# EAGLE design working (EAGLE 6.4)
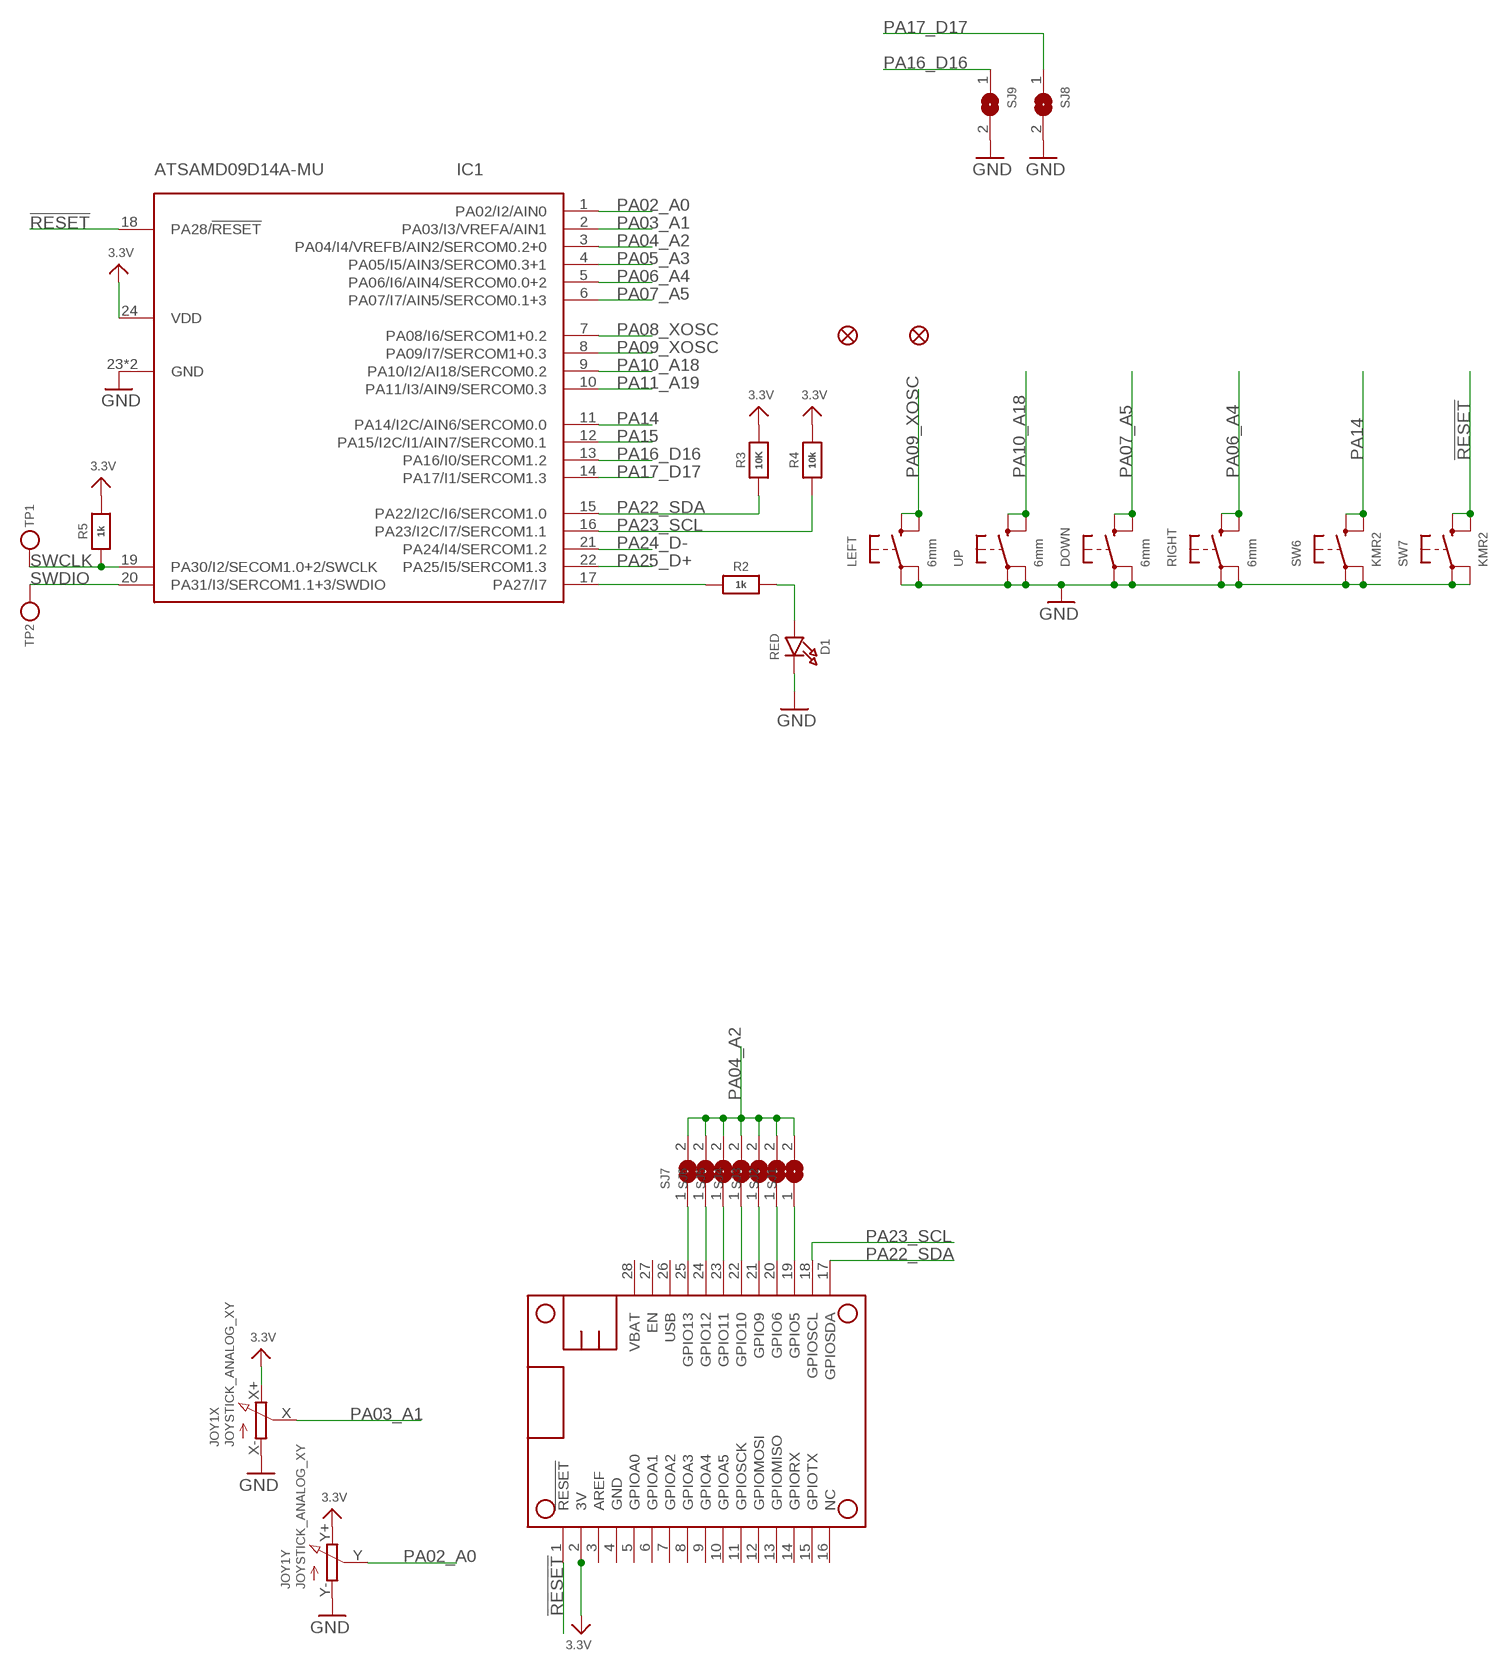
[diagram p0: schematic, sheet 1]

## Parts
D1  RED  LED0805_NOOUTLINE  [CHIPLED_0805_NOOUTLINE]
DOWN  6mm  SWITCH_TACT_SMT_EVQQ2_SMALL  [EVQ-Q2_SMALLER]
FID1  FIDUCIAL_1MM  [FIDUCIAL_1MM]
FID2  FIDUCIAL_1MM  [FIDUCIAL_1MM]
IC1  ATSAMD09D14A-MU  [QFN24_4MM]
JOY1  JOYSTICK_ANALOG_XY  [JOYSTICK_ANALOG_MINITHM]
LEFT  6mm  SWITCH_TACT_SMT_EVQQ2_SMALL  [EVQ-Q2_SMALLER]
MS1  FEATHERWING  [FEATHERWING]
R2  1k  RESISTOR_0603_NOOUT  [0603-NO]
R3  10K  RESISTOR_0603_NOOUT  [0603-NO]
R4  10k  RESISTOR_0603_NOOUT  [0603-NO]
R5  1k  RESISTOR_0603_NOOUT  [0603-NO]
RIGHT  6mm  SWITCH_TACT_SMT_EVQQ2_SMALL  [EVQ-Q2_SMALLER]
SJ1  SOLDERJUMPER  [SOLDERJUMPER_ARROW_NOPASTE]
SJ2  SOLDERJUMPER  [SOLDERJUMPER_ARROW_NOPASTE]
SJ3  SOLDERJUMPER  [SOLDERJUMPER_ARROW_NOPASTE]
SJ4  SOLDERJUMPER  [SOLDERJUMPER_ARROW_NOPASTE]
SJ5  SOLDERJUMPER  [SOLDERJUMPER_ARROW_NOPASTE]
SJ6  SOLDERJUMPER  [SOLDERJUMPER_ARROW_NOPASTE]
SJ7  SOLDERJUMPER  [SOLDERJUMPER_ARROW_NOPASTE]
SJ8  SOLDERJUMPER  [SOLDERJUMPER_ARROW_NOPASTE]
SJ9  SOLDERJUMPER  [SOLDERJUMPER_ARROW_NOPASTE]
SW6  KMR2  SWITCH_TACT_SMT4.6X2.8  [BTN_KMR2_4.6X2.8]
SW7  KMR2  SWITCH_TACT_SMT4.6X2.8  [BTN_KMR2_4.6X2.8]
TP1  TESTPOINTROUND2MM  [TESTPOINT_ROUND_2MM]
TP2  TESTPOINTROUND2MM  [TESTPOINT_ROUND_2MM]
UP  6mm  SWITCH_TACT_SMT_EVQQ2_SMALL  [EVQ-Q2_SMALLER]

## Nets
3.3V: IC1.24(VDD) JOY1.X+(X:E) JOY1.Y+(Y:E) MS1.2(3V) R3.2 R4.2 R5.2
!RESET: IC1.18(PA28/!RESET) MS1.1(!RESET) SW7.B'(S1) SW7.B(S)
GND: D1.C DOWN.A'(P1) DOWN.A(P) IC1.23(GND) IC1.THERM(GND) JOY1.X-(X:A) JOY1.Y-(Y:A) LEFT.A'(P1) LEFT.A(P) RIGHT.A'(P1) RIGHT.A(P) SJ8.2 SJ9.2 SW6.A'(P1) SW6.A(P) SW7.A'(P1) SW7.A(P) UP.A'(P1) UP.A(P)
N$1: MS1.19(GPIO5) SJ1.1
N$2: MS1.20(GPIO6) SJ2.1
N$3: MS1.21(GPIO9) SJ3.1
N$4: MS1.22(GPIO10) SJ4.1
N$5: IC1.17(PA27/I7) R2.1
N$6: MS1.23(GPIO11) SJ5.1
N$7: MS1.24(GPIO12) SJ6.1
N$8: MS1.25(GPIO13) SJ7.1
N$9: D1.A R2.2
PA02_A0: IC1.1(PA02/I2/AIN0) JOY1.Y(Y:S)
PA03_A1: IC1.2(PA03/I3/VREFA/AIN1) JOY1.X(X:S)
PA04_A2: IC1.3(PA04/I4/VREFB/AIN2/SERCOM0.2+0) SJ1.2 SJ2.2 SJ3.2 SJ4.2 SJ5.2 SJ6.2 SJ7.2
PA05_A3: IC1.4(PA05/I5/AIN3/SERCOM0.3+1)
PA06_A4: IC1.5(PA06/I6/AIN4/SERCOM0.0+2) RIGHT.B'(S1) RIGHT.B(S)
PA07_A5: DOWN.B'(S1) DOWN.B(S) IC1.6(PA07/I7/AIN5/SERCOM0.1+3)
PA08_XOSC: IC1.7(PA08/I6/SERCOM1+0.2)
PA09_XOSC: IC1.8(PA09/I7/SERCOM1+0.3) LEFT.B'(S1) LEFT.B(S)
PA10_A18: IC1.9(PA10/I2/AI18/SERCOM0.2) UP.B'(S1) UP.B(S)
PA11_A19: IC1.10(PA11/I3/AIN9/SERCOM0.3)
PA14: IC1.11(PA14/I2C/AIN6/SERCOM0.0) SW6.B'(S1) SW6.B(S)
PA15: IC1.12(PA15/I2C/I1/AIN7/SERCOM0.1)
PA16_D16: IC1.13(PA16/I0/SERCOM1.2) SJ9.1
PA17_D17: IC1.14(PA17/I1/SERCOM1.3) SJ8.1
PA22_SDA: IC1.15(PA22/I2C/I6/SERCOM1.0) MS1.17(GPIOSDA) R3.1
PA23_SCL: IC1.16(PA23/I2C/I7/SERCOM1.1) MS1.18(GPIOSCL) R4.1
PA24_D-: IC1.21(PA24/I4/SERCOM1.2)
PA25_D+: IC1.22(PA25/I5/SERCOM1.3)
SWCLK: IC1.19(PA30/I2/SECOM1.0+2/SWCLK) R5.1 TP1.P$1
SWDIO: IC1.20(PA31/I3/SERCOM1.1+3/SWDIO) TP2.P$1
Unconnected: MS1.3(AREF) MS1.5(GPIOA0) MS1.6(GPIOA1) MS1.7(GPIOA2) MS1.8(GPIOA3) MS1.9(GPIOA4) MS1.10(GPIOA5) MS1.11(GPIOSCK) MS1.12(GPIOMOSI) MS1.13(GPIOMISO) MS1.14(GPIORX) MS1.15(GPIOTX) MS1.16(NC) MS1.26(USB) MS1.27(EN) MS1.28(VBAT)

## Power pins joined to a net without a drawn wire
GND: MS1.4(GND)

## Library data of the parts
D1 = microbuilder:LED: LED 0603 - 0603 Surface Mount Package 2mA: Green LED - Low Power (3.9mcd, 2ma, 1.7Vf) - Digikey: 475-2709-2-ND Orange LED - Low Power (9.8mcd, 2ma, 1.8Vf) - Digikey: 475-1194-2-ND Red LED - Low Power (5mcd, 2ma, 1.8Vf) - Digikey: 475-1195-2-ND Yellow LED - Low Power (7mcd, 2ma, 1.8Vf) - Digikey: 475-1196-2-ND 5mA: Blue LED - Low Power (17mcd, 5ma, 2.9Vf) - Digikey: LNJ937W8CRACT-ND 0805 - 0805 Surface Mount Package 2mA: Red LED (8.8mcd, 2mA, 1.8Vf, Clear) - Low Power [Digikey: 475-2510-1-ND] Green LED (5mcd, 2mA, 1.8Vf, Clear) - Low Power [Digikey: 475-2730-1-ND] Yellow LED (11.3mcd, 2mA, 1.8Vf, Clear) - Low Power [Digikey: 475-2555-1-ND] 20mA: Red LED (104mcd, 20mA, Diffused) - LS R976 [Digikey: 475-1278-6-ND] Red LED (12mcd, 20mA, 2.0Vf, Clear) - APT2012EC [Digikey: 754-1128-1-ND] Green LED (15mcd, 20mA, 2.2Vf, Clear) - APT2012GC [Digikey: 754-1131-1-ND] Orange LED (160mcd, 20mA, 2.1Vf, Clear) - APT2012SECK [Digikey: 754-1130-1-ND] 1206 - 1206 Surface Mount Package Green LED (26mcd, 20mA, Diffused) - LG N971 [Digikey: 475-1407-6-ND] Red LED (15mcd, 20mA, Diffused) - LH N974 [Digikey: 475-1416-6-ND] Cree - Cree High-Power Surface Mount LEDs XPEBWT-L1-0000-00D50 - White 111lm 350mA 2.9Vf 6200K 110° XTEAWT-00-0000-00000LEE3 - White 114lm 350mA 2.85Vf 5000K 115° Everlight - Everlight 45-21 Series Surface Mount LEDs 45-21/QK2C-B2832AC2CB2/2T - Warm White 2000mcd 20mA 3.25Vf 3050K 120° 45-21/LK2C-B38452C4CB2/2T - Nuetral White 2000mcd 20mA 3.25Vf 4150K 120° 45-21/LK2C-B50634C6CB2/2T - Cold White 2200mcd 20mA 3.25Vf 5650K 120° PLCC2 Reverse Mount LS T77K-J1L2-1-0-2-R18-Z - Red 11.25mcd 2mA 1.8Vf 630nm 120° LO T77K-L1M2-24-Z - Orange 19.6mcd 2mA 1.8Vf 606nm 120° LY T77K-K2M1-26-Z - Yellow 15.7mcd 2mA 1.8Vf 587nm 120°
DOWN LEFT RIGHT SW6 SW7 UP = microbuilder:SWITCH_TACT_SMT: SMT Tact Switches 6x6mm - Digikey: P12940SCT-ND KMR2 (4.6x2.8mm) - Digikey: 401-1426-1-ND EVQ-PQHB55 - Light Touch, 160GF (4.5x4.5mm) - Digikey: P8090SCT-ND KMT0 - KMT021 NGJ LHS (etc.) IP68/Waterproof - Digikey: CKN10289CT-ND
FID1 FID2 = microbuilder:FIDUCIAL: Fiducial Alignment Points Various fiducial points for machine vision alignment.; BOM: EXCLUDE
IC1 = microbuilder:ATSAMD09D14A
JOY1 = microbuilder:JOYSTICK_ANALOG_XY
MS1 = microbuilder:FEATHERWING
R2-R5 = microbuilder:RESISTOR: Resistors For new designs, use the packages preceded by an '_' character since they are more reliable: The following footprints should be used on most boards: _0402 - Standard footprint for regular board layouts _0603 - Standard footprint for regular board layouts _0805 - Standard footprint for regular board layouts _1206 - Standard footprint for regular board layouts For extremely tight-pitch boards where space is at a premium, the following 'micro-pitch' footprints can be used (smaller pads, no silkscreen outline, etc.): _0402MP - Micro-pitch footprint for very dense/compact boards _0603MP - Micro-pitch footprint for very dense/compact boards _0805MP - Micro-pitch footprint for very dense/compact boards _1206MP - Micro-pitch footprint for very dense/compact boards
SJ1-SJ9 = microbuilder:SOLDERJUMPER: SMD Solder JUMPER Solder the two pads together to create a connection, or remove the solder to break it. REFLOW - Use this footprint for solder paste and reflow ovens. WAVE - Use this footprint for hand-soldering (larger pads). CLOSED - Has a trace between the two pads to ensure it is closed by default. The trace needs to be cut to disable the jumper, and can be closed again by creating a solder bridge between the two pads.; BOM: EXCLUDE
TP1 TP2 = microbuilder:TESTPOINT: Test Point Various test points for characterisation and PCB testing TESTPOINT_SMT - Compact Surface Mount Test Point [Digikey: 5016KTR-ND]

## Board
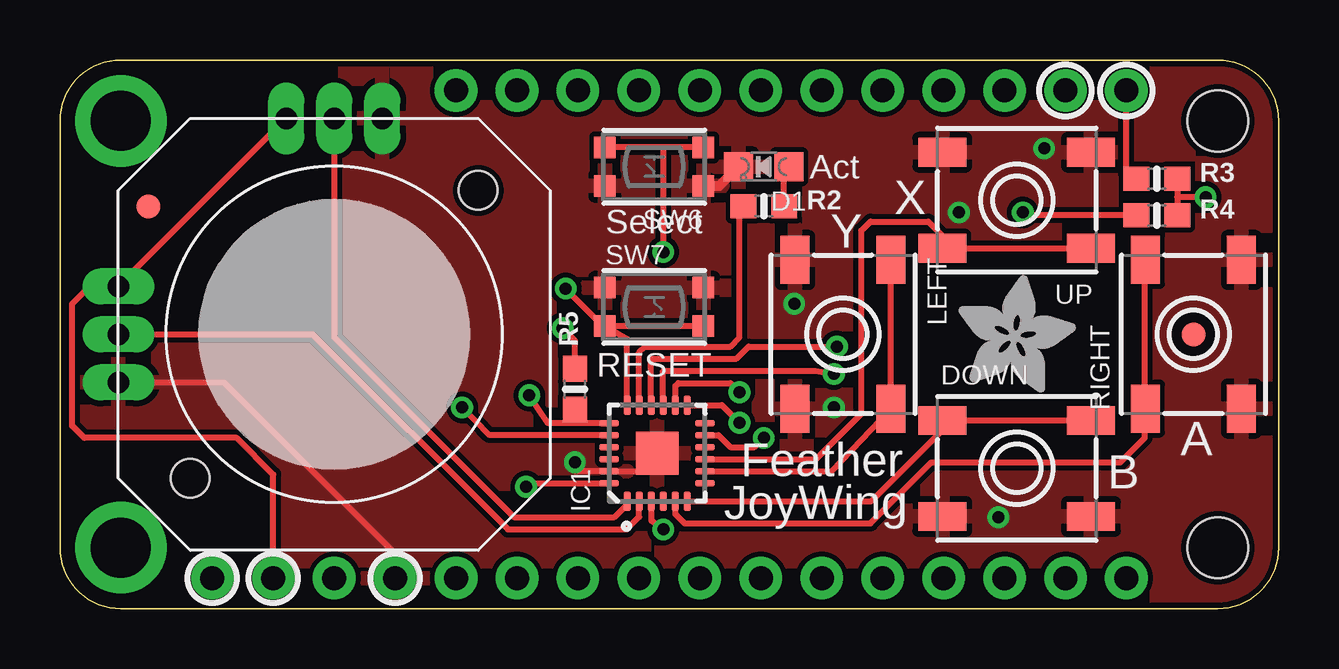
[diagram p1: board, top side]
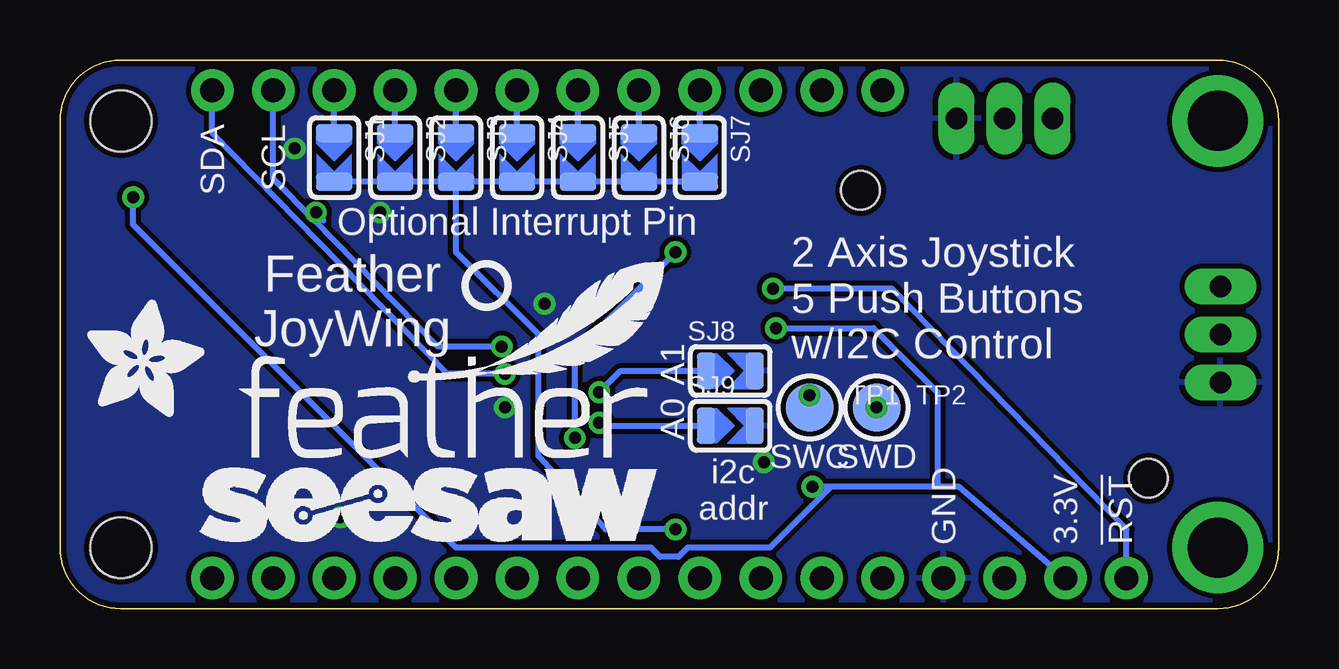
[diagram p2: board, bottom side, seen from below]

Size 50.8 x 22.86 mm. Coordinates in mm from the lower left corner, seen from the top.
Outline: 48.26,0 2.54,0 arc-90 0,2.54 0,20.32 arc-90 2.54,22.86 48.26,22.86 arc-90 50.8,20.32 50.8,2.54 arc-90 48.26,0
Copper layers (1*16): Top 0.035mm / dielectric 1.5mm / Bottom 0.035mm
Design rules "adafruit": minimum track width 8mil, minimum drill 15.5mil, track to track 8mil, track to pad 8mil, pad to pad 8mil, via to via 8mil, smd to smd 8mil, copper to edge 10mil, drill to drill 8mil, minimum pad ring 10mil, minimum via ring 8mil, stop-mask expansion 2mil, vias tented up to drill 20mil, thermal gap 10mil

### Footprints (pad centres in the part's own frame; a part is rotated, then mirrored left to right if it is on the bottom)
CHIPLED_0805_NOOUTLINE = smd 1.2 x 1.2: A 0,-1.05; C 0,1.05
EVQ-Q2_SMALLER = smd 2 x 1.2: A -3.1,-2; A' 3.1,-2; B -3.1,2; B' 3.1,2
FIDUCIAL_1MM = smd 1 x 1: 1 0,0
QFN24_4MM = smd 0.8 x 0.28: 1 -2,1.25; 2 -2,0.75; 3 -2,0.25; 4 -2,-0.25; 5 -2,-0.75; 6 -2,-1.25; 13 2,-1.25; 14 2,-0.75; 15 2,-0.25; 16 2,0.25; 17 2,0.75; 18 2,1.25 | smd 0.28 x 0.8: 7 -1.25,-2; 8 -0.75,-2; 9 -0.25,-2; 10 0.25,-2; 11 0.75,-2; 12 1.25,-2; 19 1.25,2; 20 0.75,2; 21 0.25,2; 22 -0.25,2; 23 -0.75,2; 24 -1.25,2 | smd 1.778 x 1.778: THERM 0,0
JOYSTICK_ANALOG_MINITHM = drill 0.9 pad 1.5 long: X 0,9; X+ 2,9; X- -2,9; Y 9,0; Y+ 9,2; Y- 9,-2 | hole 1.6: -6,6; 6,-6
FEATHERWING = drill 1 pad 1.778: 1 6.35,1.27; 2 8.89,1.27; 3 11.43,1.27; 4 13.97,1.27; 5 16.51,1.27; 6 19.05,1.27; 7 21.59,1.27; 8 24.13,1.27; 9 26.67,1.27; 10 29.21,1.27; 11 31.75,1.27; 12 34.29,1.27; 13 36.83,1.27; 14 39.37,1.27; 15 41.91,1.27; 16 44.45,1.27; 17 44.45,21.59; 18 41.91,21.59; 19 39.37,21.59; 20 36.83,21.59; 21 34.29,21.59; 22 31.75,21.59; 23 29.21,21.59; 24 26.67,21.59; 25 24.13,21.59; 26 21.59,21.59; 27 19.05,21.59; 28 16.51,21.59 | drill 2.5 pad 3.81: P$1 2.54,20.32; P$2 2.54,2.54 | hole 2.54: 48.26,20.32; 48.26,2.54
0603-NO = smd 1.075 x 1: 1 -0.85,0; 2 0.85,0
SOLDERJUMPER_ARROW_NOPASTE = smd 0.762 x 1.524: 1 -1.016,0; 2 1.016,0
BTN_KMR2_4.6X2.8 = smd 0.9 x 0.9: A 2.05,0.8; A' -2.05,0.8; B 2.05,-0.8; B' -2.05,-0.8
TESTPOINT_ROUND_2MM = smd 2 x 2: P$1 0,0

### Placement (x,y rotation side)
D1  29.34,18.41 90 top
DOWN  39.88,5.84 0 top
FID1  3.68,16.76 0 top
FID2  47.24,11.43 0 top
IC1  24.89,6.48 90 top
JOY1  11.43,11.43 90 top
LEFT  32.64,11.43 270 top
MS1  0,0 0 top
R2  29.34,16.76 0 top
R3  45.72,17.91 0 top
R4  45.72,16.38 0 top
R5  21.46,9.14 90 top
RIGHT  47.24,11.43 90 top
SJ1  39.37,18.8 270 bottom
SJ2  36.83,18.8 270 bottom
SJ3  34.29,18.8 270 bottom
SJ4  31.75,18.8 270 bottom
SJ5  29.21,18.8 270 bottom
SJ6  26.67,18.8 270 bottom
SJ7  24.13,18.8 270 bottom
SJ8  22.86,9.91 0 bottom
SJ9  22.86,7.62 0 bottom
SW6  24.77,18.41 180 top
SW7  24.77,12.57 0 top
TP1  19.56,8.38 0 bottom
TP2  16.76,8.38 0 bottom
U$7  [PCBFEAT-REV-040]  33.02,13.46 0 bottom
U$9  [ADAFRUIT_5MM]  37.47,9.02 0 top
U$10  [FEATHERLOGO_MED]  43.43,6.22 0 bottom
U$11  [ADAFRUIT_5MM]  49.66,8 0 bottom
U$12  [SEESAW_LOGO]  44.96,2.79 0 bottom
UP  39.88,17.02 180 top

### Tracks (layer width: path | path; a pad name or v marks a point on that pad's centre or on a via)
3.3V  (via drill 0.5)
  Top 0.254: JOY1.Y+ JOY1.X+ 1.24,13.43 0.51,12.7 0.51,7.62 1.02,7.11 7.37,7.11 8.89,5.59 MS1.2 | v19.43,5.08 19.7,5.23 IC1.24 | R3.2 46.57,17.14 | 46.57,17.14 R4.2 | R5.2 21.46,11.18 v20.95,11.68 | v47.75,17.14 46.57,17.14
  Bottom 0.254: MS1.2 13.34,5.08 14.1,5.08 | 14.1,5.08 18.67,5.08 | 18.67,5.08 v19.43,5.08 | v20.95,11.68 16.89,11.68 14.22,9.02 14.22,5.21 14.1,5.08 | 18.67,5.08 21.21,2.54 24.64,2.54 25.02,2.16 25.78,2.16 26.16,2.54 34.29,2.54 47.75,16 v47.75,17.14
!RESET  (via drill 0.5)
  Top 0.254: IC1.18 23.64,11.23 SW7.B' | SW7.B SW7.B' | v21.08,13.34 22.64,11.77 SW7.B'
  Bottom 0.254: MS1.1 6.35,3.3 16.13,13.34 v21.08,13.34
GND  (via drill 0.5)
  Top 0.254: JOY1.X- 6.83,9.43 13.97,2.29 MS1.4 | IC1.THERM 24.89,5.73 IC1.23 21.46,5.73 v21.46,6.1
  Top 0.406: SW6.A' 27.49,17.61 D1.C
  other vias: 32.26,8.38 30.61,12.7 37.47,16.51 41.02,19.18 39.12,3.81
  pour Bottom: 0,22.86 0,0 50.8,0 50.8,22.86
  pour Top: -0.13,23.5 -0.13,-0.38 51.44,-0.38 51.44,23.5
N$1
  Bottom 0.254: SJ1.1 MS1.19
N$2
  Bottom 0.254: SJ2.1 MS1.20
N$3
  Bottom 0.254: SJ3.1 MS1.21
N$4
  Bottom 0.254: SJ4.1 MS1.22
N$5
  Top 0.254: IC1.17 24.14,10.68 24.38,10.92 27.94,10.92 28.32,11.3 28.32,16.6 R2.1
N$6
  Bottom 0.254: SJ5.1 MS1.23
N$7
  Bottom 0.254: SJ6.1 MS1.24
N$8
  Bottom 0.254: SJ7.1 MS1.25
N$9
  Top 0.254: R2.2 30.19,18.06 D1.A
PA02_A0
  Top 0.254: JOY1.Y 11.43,11.3 18.92,3.81 23.11,3.81 23.62,4.32 23.62,4.46 IC1.1
PA03_A1
  Top 0.254: JOY1.X 10.54,11.43 18.67,3.3 23.62,3.3 24.14,3.82 IC1.2
PA04_A2  (via drill 0.5)
  Top 0.254: IC1.3 24.64,3.68 v25.15,3.3
  Bottom 0.254: SJ7.2 SJ6.2 SJ5.2 SJ4.2 SJ3.2 | 34.8,17.78 SJ3.2 | SJ3.2 SJ2.2 SJ1.2 | v25.15,3.3 28.07,3.3 30.86,6.35 30.86,11.43 34.29,14.86 SJ3.2
PA06_A4
  Top 0.254: RIGHT.B' 45.24,14.95 45.21,14.99 45.21,8.36 RIGHT.B 45.21,8.3 45.21,7.11 44.2,6.1 36.32,6.1 33.78,3.56 26.04,3.56 25.64,3.95 IC1.5
PA07_A5
  Top 0.254: IC1.6 33.81,4.48 36.78,7.44 DOWN.B DOWN.B'
PA09_XOSC
  Top 0.254: IC1.8 32.16,5.73 LEFT.B' LEFT.B
PA10_A18
  Top 0.254: IC1.9 31.5,6.23 33.4,8.13 33.4,15.75 33.78,16.13 36.2,16.13 36.78,15.55 UP.B' UP.B
PA14  (via drill 0.5)
  Top 0.254: v25.15,14.86 25.15,19.21 | 25.15,19.21 SW6.B | SW6.B' 25.15,19.21 | IC1.11 27.44,7.23 27.94,6.73 28.96,6.73 v29.34,7.11
  Bottom 0.254: v29.34,7.11 29.34,10.67 v25.15,14.86
PA16_D16  (via drill 0.5)
  Top 0.254: IC1.13 27.59,8.48 v28.32,7.75
  Bottom 0.254: v28.32,7.75 27.94,7.62 SJ9.1
PA17_D17  (via drill 0.5)
  Top 0.254: IC1.14 25.65,8.49 25.65,9.27 25.78,9.4 27.94,9.4 v28.32,9.02
  Bottom 0.254: v28.32,9.02 27.43,9.91 SJ8.1
PA22_SDA  (via drill 0.5)
  Top 0.254: MS1.17 44.45,18.03 44.58,17.91 R3.1 | IC1.15 25.14,9.9 25.15,9.91 31.5,9.91 v32.26,9.78
  Bottom 0.254: v32.26,9.78 34.67,9.78 44.45,19.81 MS1.17
PA23_SCL  (via drill 0.5)
  Top 0.254: IC1.16 24.64,10.41 28.19,10.41 28.7,10.92 v32.38,10.92 | R4.1 40.26,16.38 v40.13,16.51
  Bottom 0.254: v32.38,10.92 35.05,10.92 40.21,16.18 | 40.21,16.18 41.91,17.91 MS1.18 | v40.13,16.51 39.83,16.18 40.21,16.18
SWCLK  (via drill 0.5)
  Top 0.254: IC1.19 21.46,7.73 | 21.46,7.73 20.34,7.73 v19.56,8.89 | R5.1 21.46,7.73
  Bottom 0.254: v19.56,8.89 TP1.P$1
SWDIO  (via drill 0.5)
  Top 0.254: IC1.20 17.89,7.23 TP2.P$1
  other vias: 16.76,8.38

### Text on the board
tPlace: Act | X | Select | Y | RESET | A | Feather | B | JoyWing
bPlace: SCL | SDA | Optional Interrupt Pin | 2 Axis Joystick / 5 Push Buttons / w/I2C Control | Feather / JoyWing | A1 | A0 | SWD | SWC | i2c / addr | !RST | 3.3V | GND